# EAGLE schematic armm0 (EAGLE 9.1.0)
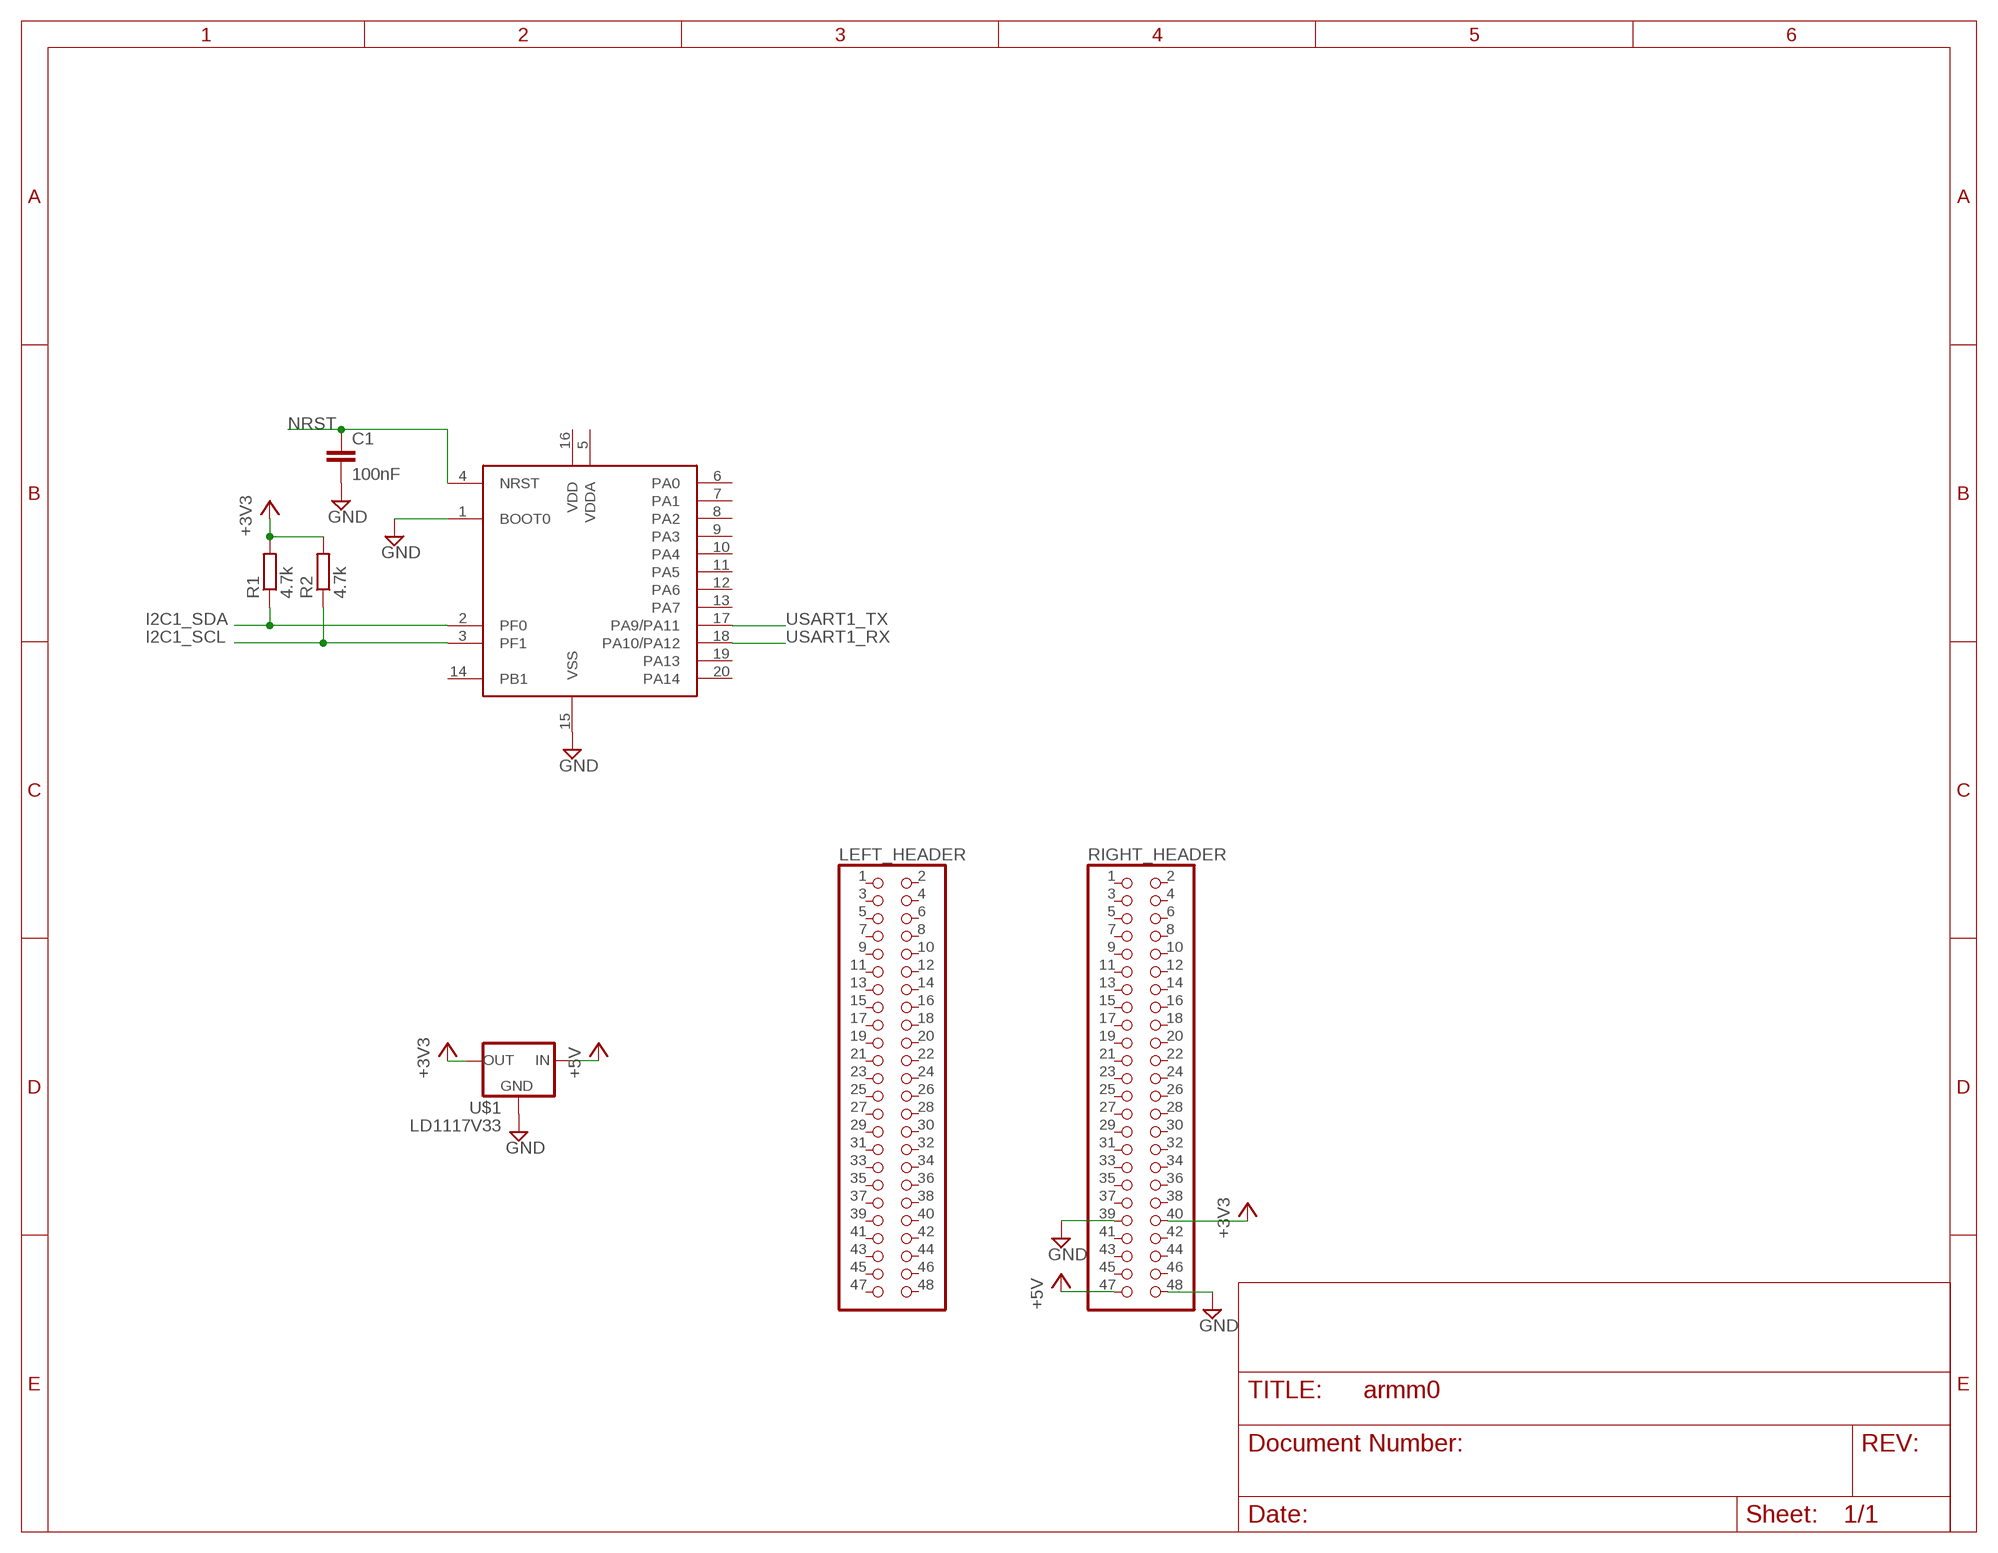
[diagram p0: schematic, sheet 1]

## Parts
C1  100nF  C-EUC1206  [C1206]
LEFT_HEADER  PINHD-2X24  [2X24]
R1  4.7k  R-EU_R1206  [R1206]
R2  4.7k  R-EU_R1206  [R1206]
RIGHT_HEADER  PINHD-2X24  [2X24]
U$1  LD1117V33  [LD1117V33]
U$2  STM32F070F6  [TSSOP20]

## Nets
+3V3: R1.2 R2.2 RIGHT_HEADER.40 U$1.OUT
+5V: RIGHT_HEADER.47 U$1.IN
GND: C1.2 RIGHT_HEADER.48 U$1.GND U$2.1(BOOT0) U$2.15(VSS)
I2C1_SCL: R2.1 U$2.3(PF1)
I2C1_SDA: R1.1 U$2.2(PF0)
N$1: RIGHT_HEADER.39 ; supply symbol labelled GND
NRST: C1.1 U$2.4(NRST)
USART1_RX: U$2.18(PA10/PA12)
USART1_TX: U$2.17(PA9/PA11)
Unconnected: LEFT_HEADER.1 LEFT_HEADER.2 LEFT_HEADER.3 LEFT_HEADER.4 LEFT_HEADER.5 LEFT_HEADER.6 LEFT_HEADER.7 LEFT_HEADER.8 LEFT_HEADER.9 LEFT_HEADER.10 LEFT_HEADER.11 LEFT_HEADER.12 LEFT_HEADER.13 LEFT_HEADER.14 LEFT_HEADER.15 LEFT_HEADER.16 LEFT_HEADER.17 LEFT_HEADER.18 LEFT_HEADER.19 LEFT_HEADER.20 LEFT_HEADER.21 LEFT_HEADER.22 LEFT_HEADER.23 LEFT_HEADER.24 LEFT_HEADER.25 LEFT_HEADER.26 LEFT_HEADER.27 LEFT_HEADER.28 LEFT_HEADER.29 LEFT_HEADER.30 LEFT_HEADER.31 LEFT_HEADER.32 LEFT_HEADER.33 LEFT_HEADER.34 LEFT_HEADER.35 LEFT_HEADER.36 LEFT_HEADER.37 LEFT_HEADER.38 LEFT_HEADER.39 LEFT_HEADER.40 LEFT_HEADER.41 LEFT_HEADER.42 LEFT_HEADER.43 LEFT_HEADER.44 LEFT_HEADER.45 LEFT_HEADER.46 LEFT_HEADER.47 LEFT_HEADER.48 RIGHT_HEADER.1 RIGHT_HEADER.2 RIGHT_HEADER.3 RIGHT_HEADER.4 RIGHT_HEADER.5 RIGHT_HEADER.6 RIGHT_HEADER.7 RIGHT_HEADER.8 RIGHT_HEADER.9 RIGHT_HEADER.10 RIGHT_HEADER.11 RIGHT_HEADER.12 RIGHT_HEADER.13 RIGHT_HEADER.14 RIGHT_HEADER.15 RIGHT_HEADER.16 RIGHT_HEADER.17 RIGHT_HEADER.18 RIGHT_HEADER.19 RIGHT_HEADER.20 RIGHT_HEADER.21 RIGHT_HEADER.22 RIGHT_HEADER.23 RIGHT_HEADER.24 RIGHT_HEADER.25 RIGHT_HEADER.26 RIGHT_HEADER.27 RIGHT_HEADER.28 RIGHT_HEADER.29 RIGHT_HEADER.30 RIGHT_HEADER.31 RIGHT_HEADER.32 RIGHT_HEADER.33 RIGHT_HEADER.34 RIGHT_HEADER.35 RIGHT_HEADER.36 RIGHT_HEADER.37 RIGHT_HEADER.38 RIGHT_HEADER.41 RIGHT_HEADER.42 RIGHT_HEADER.43 RIGHT_HEADER.44 RIGHT_HEADER.45 RIGHT_HEADER.46 U$2.5(VDDA) U$2.6(PA0) U$2.7(PA1) U$2.8(PA2) U$2.9(PA3) U$2.10(PA4) U$2.11(PA5) U$2.12(PA6) U$2.13(PA7) U$2.14(PB1) U$2.16(VDD) U$2.19(PA13) U$2.20(PA14)

## Library data of the parts
C1 = rcl:C-EU: CAPACITOR, European symbol; SPICEPREFIX: C
LEFT_HEADER RIGHT_HEADER = pinhead:PINHD-2X24: PIN HEADER
R1 R2 = resistor:R-EU_: RESISTOR, European symbol
U$1 = LD1117V33:LD1117V33
U$2 = armm0:STM32F070F6